# Altium schematic sheet Sheet1.SchDoc
size A4
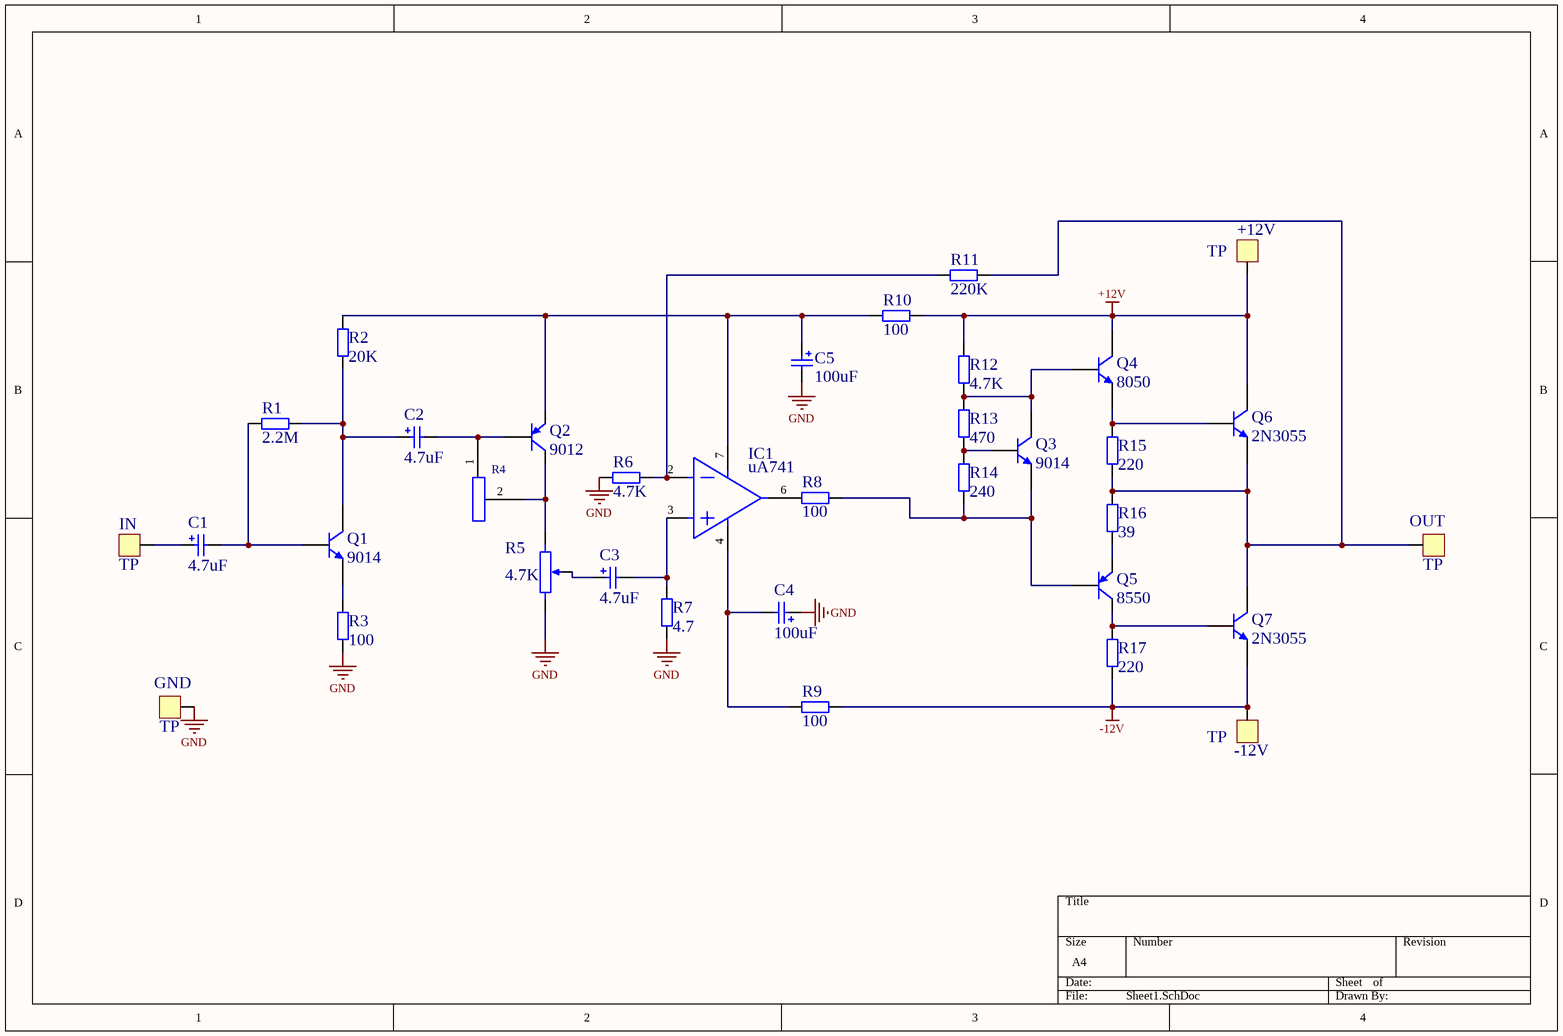
[diagram p0: Sheet1.SchDoc]

## Parts
+12V  TP  [TP2]
-12V  TP  [TP2]
C1  value 4.7uF  [CAPPR5-5x5]  (hidden comment: Cap Pol2)
C2  value 4.7uF  [CAPPR5-5x5]  (hidden comment: Cap Pol2)
C3  value 4.7uF  [CAPPR5-5x5]  (hidden comment: Cap Pol2)
C4  value 100uF  [CAPPR5-5x5]  (hidden comment: Cap Pol2)
C5  value 100uF  [CAPPR5-5x5]  (hidden comment: Cap Pol2)
GND  TP  [TP2]
IC1  uA741  [DIP8]
IN  TP  [TP2]
OUT  TP  [TP2]
Q1  9014  [TANS]
Q2  9012  [TANS]
Q3  9014  [TANS]
Q4  8050  [TANS]
Q5  8550  [TANS]
Q6  2N3055  [TO-3]
Q7  2N3055  [TO-3]
R1  value 2.2M  [AXIAL-0.4]  (hidden comment: Res2)
R2  value 20K  [AXIAL-0.4]  (hidden comment: Res2)
R3  value 100  [AXIAL-0.4]  (hidden comment: Res2)
R4  vari-Res  [vari-Res]  (value not drawn)
R5  value 4.7K  [RPOT]  (hidden comment: RPOT)
R6  value 4.7K  [AXIAL-0.4]  (hidden comment: Res2)
R7  value 4.7  [AXIAL-0.4]  (hidden comment: Res2)
R8  value 100  [AXIAL-0.4]  (hidden comment: Res2)
R9  value 100  [AXIAL-0.4]  (hidden comment: Res2)
R10  value 100  [AXIAL-0.4]  (hidden comment: Res2)
R11  value 220K  [AXIAL-0.4]  (hidden comment: Res2)
R12  value 4.7K  [AXIAL-0.4]  (hidden comment: Res2)
R13  value 470  [AXIAL-0.4]  (hidden comment: Res2)
R14  value 240  [AXIAL-0.4]  (hidden comment: Res2)
R15  value 220  [AXIAL-0.4]  (hidden comment: Res2)
R16  value 39  [AXIAL-0.4]  (hidden comment: Res2)
R17  value 220  [AXIAL-0.4]  (hidden comment: Res2)

## Nets
1: IC1.1
8: IC1.8
+12V: +12V.1 Q4.3(C) Q6.3(C) R10.2 R12.2
-12V: -12V.1 Q7.2(E) R9.2 R17.1
GND: C4.1 C5.2 GND.1 R3.1 R5.3(BOT) R6.1 R7.1
NetC1_1: C1.1 IN.1
NetC1_2: C1.2 Q1.2(B) R1.1
NetC2_1: C2.1 Q1.3(C) R1.2 R2.1
NetC2_2: C2.2 Q2.2(B) R4.1(TOP)
NetC3_1: C3.1 R5.2(TAP)
NetC3_2: C3.2 IC1.3 R7.2
NetC4_2: C4.2 IC1.4 R9.1
NetC5_1: C5.1 IC1.7 Q2.1(E) R2.2 R10.1
NetIC1_2: IC1.2 R6.2 R11.1
NetIC1_6: IC1.6 R8.1
NetOUT_1: OUT.1 Q6.2(E) Q7.3(C) R11.2 R15.1 R16.2
NetQ1_1: Q1.1(E) R3.2
NetQ2_3: Q2.3(C) R4.2(TAP) R5.1(TOP)
NetQ3_1: Q3.1(E) Q5.2(B) R8.2 R14.1
NetQ3_2: Q3.2(B) R13.1 R14.2
NetQ3_3: Q3.3(C) Q4.2(B) R12.1 R13.2
NetQ4_1: Q4.1(E) Q6.1(B) R15.2
NetQ5_1: Q5.1(E) R16.1
NetQ5_3: Q5.3(C) Q7.1(B) R17.2

## Library data of the parts
C1-C5 = Cap Pol2: Polarized Capacitor (Axial); Published: 8-Jun-2000; LatestRevisionDate: 17-Jul-2002; LatestRevisionNote: Re-released for DXP Platform.; PackageReference: POLAR0.8; Publisher: Altium Limited
IC1 = uA741: OAP
Q1 Q3 = 2N3904: NPN General Purpose Amplifier; Published: 8-Jun-2000; LatestRevisionDate: 15-Jan-2003; LatestRevisionNote: PCB Footprint 'BCY-W3/D4.7' replaced; DatasheetDocument: 1997; PackageDocument: Sep-1998; PackageReference: TO-92A; Publisher: Altium Limited; Code_JEDEC: TO-92A; ComponentLink1Description: Manufacturer Link; ComponentLink1URL: http://www.fairchildsemi.com/; ComponentLink2Description: Datasheet; ComponentLink2URL: http://www.fairchildsemi.com/ds/2N%2F2N3904.pdf
Q2 = 9012: PNP Transistor
Q4 = 8050: NPN General Purpose Amplifier; Published: 8-Jun-2000; LatestRevisionDate: 15-Jan-2003; LatestRevisionNote: PCB Footprint 'BCY-W3/D4.7' replaced; DatasheetDocument: 1997; PackageDocument: Sep-1998; PackageReference: TO-92A; Publisher: Altium Limited; Code_JEDEC: TO-92A; ComponentLink1Description: Manufacturer Link; ComponentLink1URL: http://www.fairchildsemi.com/; ComponentLink2Description: Datasheet; ComponentLink2URL: http://www.fairchildsemi.com/ds/2N%2F2N3904.pdf
Q5 = 8550: PNP Transistor
Q6 Q7 = 2N3055: NPN General Purpose Amplifier; Published: 8-Jun-2000; LatestRevisionDate: 15-Jan-2003; LatestRevisionNote: PCB Footprint 'BCY-W3/D4.7' replaced; DatasheetDocument: 1997; PackageDocument: Sep-1998; PackageReference: TO-92A; Publisher: Altium Limited; Code_JEDEC: TO-92A; ComponentLink1Description: Manufacturer Link; ComponentLink1URL: http://www.fairchildsemi.com/; ComponentLink2Description: Datasheet; ComponentLink2URL: http://www.fairchildsemi.com/ds/2N%2F2N3904.pdf
R1-R3 R6-R17 = Res2: Resistor; Published: 8-Jun-2000; LatestRevisionDate: 17-Jul-2002; LatestRevisionNote: Re-released for DXP Platform.; PackageReference: AXIAL-0.4; Publisher: Altium Limited
R5 = RPOT: Potentiometer